# Altium schematic sheet 或非门.SchDoc
size A4
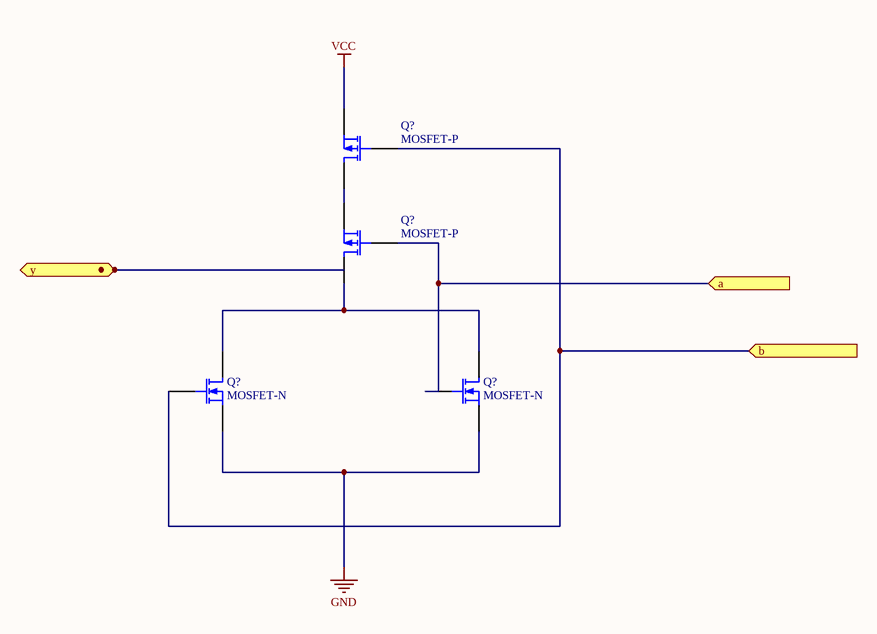
[diagram p0: 或非门.SchDoc]

## Parts
(Parts that share a designator on the sheet are numbered #1, #2 ... from top to bottom, then left to right.)
Q?#1  MOSFET-P  [E3]
Q?#2  MOSFET-P  [E3]
Q?#3  MOSFET-N  [E3]
Q?#4  MOSFET-N  [E3]

## Ports
a (in), b (in), y (out)

## Nets
GND: Q?#3.3(S) Q?#4.3(S)
VCC: Q?#1.3(S)
a: Q?#2.2(G) Q?#4.2(G) ; port a
b: Q?#1.2(G) Q?#3.2(G) ; port b
NetQ?#1_1: Q?#1.1(D) Q?#2.3(S)
NetQ?#2_1: Q?#2.1(D) Q?#3.1(D) Q?#4.1(D)

## Library data of the parts
Q?#1 Q?#2 = MOSFET-P: P-Channel MOSFET; Published: 8-Jun-2000; LatestRevisionDate: 17-Jul-2002; LatestRevisionNote: Re-released for DXP Platform.; PackageVersion: 1995/1996; PackageReference: E3; Publisher: Altium Limited; PackageDescription: TO, Flat Index; 3 In-Line, Axial Leads; Body Dia. 4.6mm; Lead Dia. 0.5 mm (max)
Q?#3 Q?#4 = MOSFET-N: N-Channel MOSFET; Published: 8-Jun-2000; LatestRevisionDate: 17-Jul-2002; LatestRevisionNote: Re-released for DXP Platform.; PackageVersion: 1995/1996; PackageReference: E3; Publisher: Altium Limited; PackageDescription: TO, Flat Index; 3 In-Line, Axial Leads; Body Dia. 4.6mm; Lead Dia. 0.5 mm (max)